# EAGLE schematic Actuator_control_v6 (EAGLE 9.7.0)
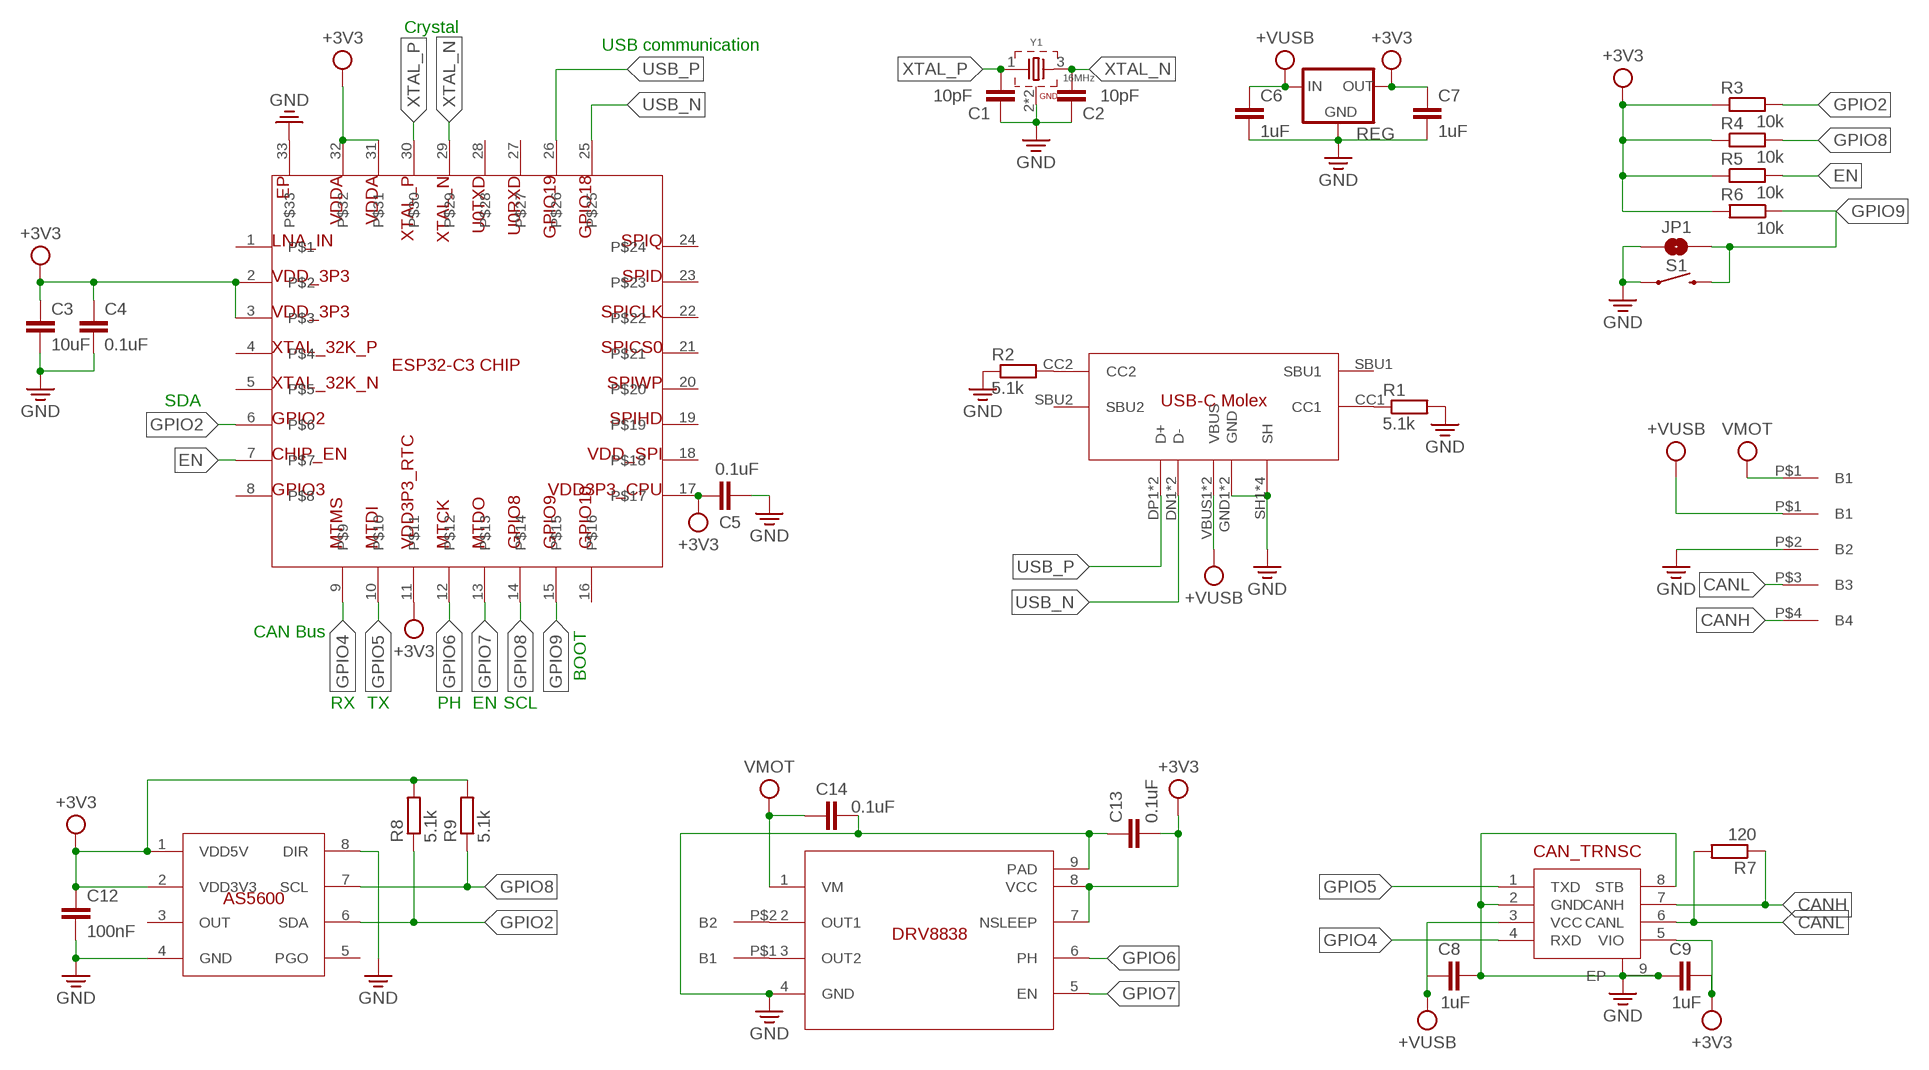
[diagram p0: schematic, sheet 1]

## Parts
AS5600  AS5600  [SOIC127P600X175-8N]
C1  10pF  C-EUC0402  [C0402]
C2  10pF  C-EUC0402  [C0402]
C3  10uF  C-EUC0402  [C0402]
C4  0.1uF  C-EUC0402  [C0402]
C5  0.1uF  C-EUC0402  [C0402]
C6  1uF  C-EUC0402  [C0402]
C7  1uF  C-EUC0402  [C0402]
C8  1uF  C-EUC0402  [C0402]
C9  1uF  C-EUC0402  [C0402]
C12  100nF  C-EUC0402  [C0402]
C13  0.1uF  C-EUC0402  [C0402]
C14  0.1uF  C-EUC0402  [C0402]
CAN  CAN_TRNSC  [SON65P300X300X75-9T160X240N]
DRV8838  DRV8838  [SON50P200X200X80-9T90X160N]
ESP32  ESP32-C3CHIP  [ESP32-C3_CHIP]
JP1  JUMPER-SMT_2_NO_SILK  [SMT-JUMPER_2_NO_SILK]
R1  5.1k  R-EU_R0402  [R0402]
R2  5.1k  R-EU_R0402  [R0402]
R3  10k  R-EU_R0402  [R0402]
R4  10k  R-EU_R0402  [R0402]
R5  10k  R-EU_R0402  [R0402]
R6  10k  R-EU_R0402  [R0402]
R7  120  R-EU_R0402  [R0402]
R8  5.1k  R-EU_R0402  [R0402]
R9  5.1k  R-EU_R0402  [R0402]
REG  XC63FPM  [SOT23]
S1  MOMENTARY-SWITCH-SPST-SMD-6.0X3.5MM  [TACTILE_SWITCH_SMD_6.0X3.5MM]
U$3  USB-CMOLEX  [USB-CMOLEX]
U$6  BREAKOUT_44-SMD2.54  [BREAKOUT_4_SMD_2.54]
U$7  BREAKOUT_11-SMD-2.54  [BREAKOUT_1_SMD_2.54]
U$8  BREAKOUT_22-THT  [BREAKOUT_2_THT]
Y1  16MHz  WE-XTAL_CFPX-180_830035264  [WE-XTAL_CFPX-180]

## Nets
+3V3: AS5600.1(VDD5V) AS5600.2(VDD3V3) C3.1 C4.1 C5.2 C7.1 C9.2 C12.1 C13.2 CAN.5(VIO) DRV8838.7(NSLEEP) DRV8838.8(VCC) ESP32.2 ESP32.3 ESP32.11 ESP32.17 ESP32.31 ESP32.32 R3.1 R4.1 R5.1 R6.2 R8.2 R9.2 REG.2(OUT)
+VUSB: C6.1 C8.1 CAN.3(VCC) REG.3(IN) U$3.VBUS1(VBUS) U$3.VBUS2(VBUS) U$6.P$1(B1)
CANH: CAN.7(CANH) R7.1 U$6.P$4(B4)
CANL: CAN.6(CANL) R7.2 U$6.P$3(B3)
EN: ESP32.7 R5.2
GND: AS5600.4(GND) AS5600.8(DIR) C1.1 C2.1 C3.2 C4.2 C5.1 C6.2 C7.2 C8.2 C9.1 C12.2 C13.1 C14.2 CAN.2(GND) CAN.8(STB) CAN.9(EP) DRV8838.4(GND) DRV8838.9(PAD) ESP32.33 JP1.1 R1.2 R2.1 REG.1(GND) S1.1 U$3.GND1(GND) U$3.GND2(GND) U$3.SH1(SH) U$3.SH2(SH) U$3.SH3(SH) U$3.SH4(SH) U$6.P$2(B2) Y1.2(GND) Y1.4(GND)
GPIO2: AS5600.6(SDA) ESP32.6 R3.2 R8.1
GPIO4: CAN.4(RXD) ESP32.9
GPIO5: CAN.1(TXD) ESP32.10
GPIO6: DRV8838.6(PH) ESP32.12
GPIO7: DRV8838.5(EN) ESP32.13
GPIO8: AS5600.7(SCL) ESP32.14 R4.2 R9.1
GPIO9: ESP32.15 JP1.2 R6.1 S1.2
N$1: R1.1 U$3.CC1
N$2: R2.2 U$3.CC2
N$3: DRV8838.3(OUT2) U$8.P$1(B1)
N$4: DRV8838.2(OUT1) U$8.P$2(B2)
USB_N: ESP32.25 U$3.DN1(D-) U$3.DN2(D-)
USB_P: ESP32.26 U$3.DP1(D+) U$3.DP2(D+)
VMOT: C14.1 DRV8838.1(VM) U$7.P$1(B1)
XTAL_N: C2.2 ESP32.29 Y1.3
XTAL_P: C1.2 ESP32.30 Y1.1
Unconnected: ESP32.1 ESP32.4 ESP32.5 ESP32.8 ESP32.16 ESP32.18 ESP32.19 ESP32.20 ESP32.21 ESP32.22 ESP32.23 ESP32.24 ESP32.27 ESP32.28 U$3.SBU1 U$3.SBU2

## Notes on the sheet
- Crystal
- USB communication
- SDA
- CAN Bus
- BOOT
- RX | TX | PH | EN | SCL

## Power pins joined to a net without a drawn wire
OUT: AS5600.3(OUT)
PGO: AS5600.5(PGO)

## Library data of the parts
AS5600 = General custom parts:AS5600
C1-C9 C12-C14 = resistor:C-EU: CAPACITOR, European symbol
CAN = General custom parts:CAN_TRNSC
DRV8838 = General custom parts:DRV8838
ESP32 = ESP32-C3 CHIP:ESP32-C3CHIP
JP1 = SparkFun-Jumpers:JUMPER-SMT_2_NO: Normally open jumper This jumper has two pads in close proximity to each other. Apply solder to close the connection. Round pads are easier to solder for beginners, but are a lot larger. SparkFun Product that uses the round pads: SparkFun EL Sequencer <https://www.sparkfun.com/products/12781>
R1-R9 = resistor:R-EU_: RESISTOR, European symbol
REG = v-reg:XC63FP: Positiv Voltage Regulators www.torex.co.jp/english/product/pro02/pdf/0201_xc62fp.pdf
S1 = SparkFun-Switches:MOMENTARY-SWITCH-SPST: Momentary Switch (Pushbutton) - SPST Normally-open (NO) SPST momentary switches (buttons, pushbuttons). Variants PTH-12MM - 12mm square, through-hole Momentary Pushbutton Switch - 12mm Square <https://www.sparkfun.com/products/9190> (COM-09190) PTH-6.0MM, PTH-6.0MM-KIT - 6.0mm square, through-hole Mini Pushbutton Switch <https://www.sparkfun.com/products/97> (COM-00097) KIT package intended for soldering kit's - only one side of pads' copper is exposed. PTH-RIGHT-ANGLE-KIT - Right-angle, through-hole Right Angle Tactile Button <https://www.sparkfun.com/products/10791> - Used on SparkFun BigTime Watch Kit <https://www.sparkfun.com/products/11734> SMD-12MM - 12mm square, surface-mount Tactile Button - SMD (12mm) <https://www.sparkfun.com/products/12993> (COM-12993) Used on SparkFun PicoBoard <https://www.sparkfun.com/products/11888> SMD-4.5MM - 4.5mm Square Trackball Switch Used on SparkFun Blackberry Trackballer Breakout <https://www.sparkfun.com/products/13169> SMD-4.6MMX2.8MM - 4.60mm x 2.80mm, surface mount Used on SparkFun Pro Micro - RP2040 <https://www.sparkfun.com/products/17717> SMD-5.2MM, SMD-5.2-REDUNDANT - 5.2mm square, surface-mount Mini Pushbutton Switch - SMD <https://www.sparkfun.com/products/8720> (COM-08720) Used on Arduino Pro Mini <https://www.sparkfun.com/products/11114> REDUNDANT package connects both switch circuits together SMD-6.0X3.5MM - 6.0 x 3.5mm, surface mount Momentary Reset Switch SMD <https://www.sparkfun.com/products/8229> (COM-08229) SMD-6.2MM-TALL - 6.2mm square, surface mount Tactile Button - SMD (6mm) <https://www.sparkfun.com/products/12992> Used on SparkFun Digital Sandbox <https://www.sparkfun.com/products/12651> SMD-RIGHT-ANGLE - Right-angle, surface mount Used on SparkFun Block for Intel® Edison - Arduino <https://www.sparkfun.com/products/13036>; PROD_ID: SWCH-14278; SF_SKU: COM-08229
U$3 = General custom parts:USB-CMOLEX
U$6 = General custom parts:BREAKOUT_4
U$7 = General custom parts:BREAKOUT_1
U$8 = General custom parts:BREAKOUT_2
Y1 = Wurth_Quartz Crystals & Oscillators_WE-XTAL:WE-XTAL_CFPX-180: WE-XTAL Quartz Crystal Characteristics SMT and THT models Hermetically sealed Frequencies between 1.8432 MHz and 50 MHz Tolerances down to ±10 ppm available Maximum operating temperatures range: -40 °C to 85 °C Stabilities down to ±10 ppm available Applications Microprocessor Wireless Communication Devices Industrial Devices Wired Communication (e.g. Ethernet and USB) IoT Optical Network Audio and Multimedia Devices Test and Measurement Equipment Navigation and Locators Wearables <https://www.we-online.com/catalog/media/o135919v209%20Family_WE-XTAL_IQXC-42.jpg> Details see: https://www.we-online.com/catalog/en/WE-XTAL Updated by Ella Wu , 2020-11-23 2020 (C) Wurth Elektronik; C-LOAD: 16pF; DATASHEET-URL: https://www.we-online.com/catalog/datasheet/830035264.pdf; MOUNT: SMT; PART-NUMBER: 830035264; STABILITY: 50ppm; TOLERANCE: ±50ppm